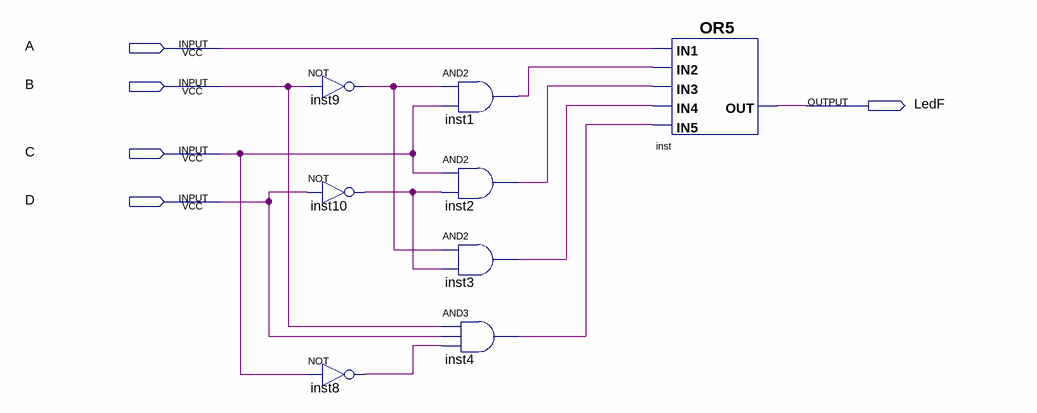
[diagram p0: schematic sheet]
// Quartus schematic LEDbcdF.bdf as structural Verilog: 8 symbols, 5 pins
module LEDbcdF (
  input  A,
  input  B,
  input  C,
  input  D,
  output LedF
);

  wire inst1_out, inst2_out, inst3_out, inst4_out, inst8_out, inst9_out, inst10_out;

  not inst9 (inst9_out, B);
  not inst10 (inst10_out, D);
  not inst8 (inst8_out, C);
  and inst1 (inst1_out, inst9_out, C);
  and inst2 (inst2_out, C, inst10_out);
  and inst3 (inst3_out, inst9_out, inst10_out);
  and inst4 (inst4_out, B, D, inst8_out);
  or inst (LedF, A, inst1_out, inst2_out, inst3_out, inst4_out);
endmodule
